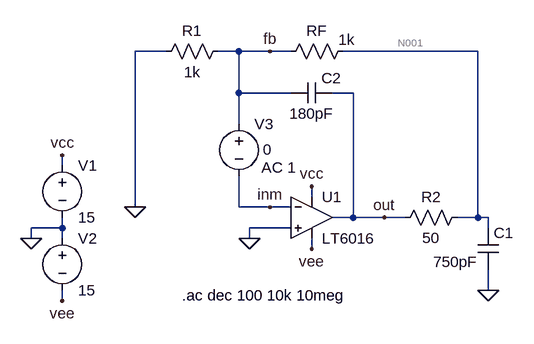
[diagram p0: schematic 02-open_loop_stability_lt6016_cload.asc]
* 02-open_loop_stability_lt6016_cload.asc
V1 vcc 0 15
V2 0 vee 15
R1 fb 0 1k
RF N001 fb 1k
* U1: LT6016 (symbol OpAmps\LT6016 not available, pins judged from their places): In+=0 In-=inm V+=vcc V-=vee OUT=out
V3 fb inm 0 AC 1
C1 N001 0 750pF
R2 N001 out 50
C2 out fb 180pF
.ac dec 100 10k 10meg
.backanno
.end

* Results of the author's LTspice run, read from the files saved beside the schematic
* Operating Point, zero values left out:
*   V(vcc) = 15 V
*   V(vee) = -15 V
*   V(fb) = -20.2 nV
*   V(n001) = 1.727 µV
*   V(out) = 1.814 µV
*   V(inm) = -20.2 nV
*   I(R2) = -1.747 nA
*   I(Rf) = 1.747 nA
*   I(R1) = -20.2 pA
*   I(V3) = 1.767 nA
*   I(V2) = -345.9 µA
*   I(V1) = -345.9 µA
*   Ix(u1:1) = 1.767 nA
*   Ix(u1:2) = 1.767 nA
*   Ix(u1:3) = 345.9 µA
*   Ix(u1:4) = -345.9 µA
*   Ix(u1:5) = -1.733 nA
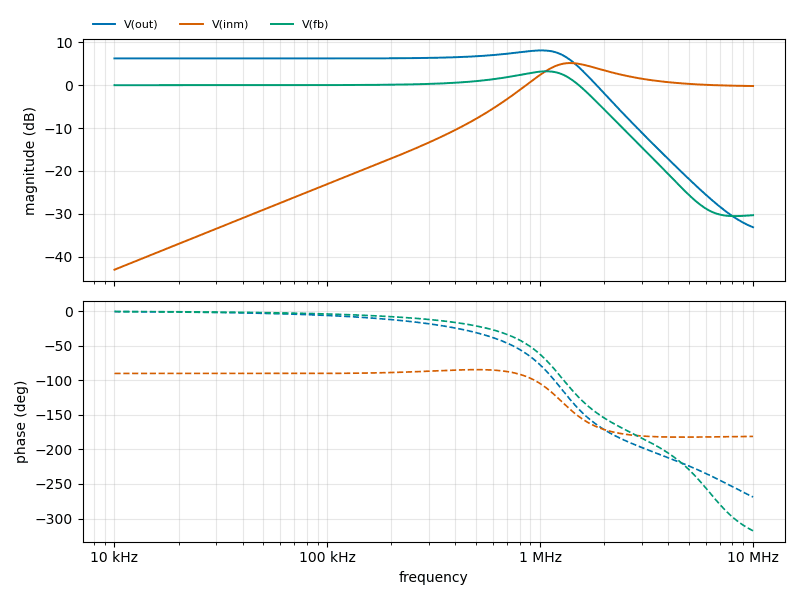
[diagram p1: AC Analysis of 02-open_loop_stability_lt6016_cload.asc, plotted from the saved traces]
* AC Analysis, 1 run:
*   V(out): 6.24 dB at 10 kHz, -33.11 dB at 10 MHz, peak 8.10 dB at 1.023 MHz, 3 dB below the peak at 1.449 MHz
*   V(inm): -43.00 dB at 10 kHz, -0.20 dB at 10 MHz, peak 5.15 dB at 1.38 MHz, 3 dB below the peak at 982.4 kHz and 2.559 MHz
*   V(fb): 0.00 dB at 10 kHz, -30.30 dB at 10 MHz, peak 3.24 dB at 1.072 MHz, 3 dB below the peak at 268 kHz and 1.5 MHz